# Altium schematic sheet ABM7-16.000MHZ-D2Y-T_2022-10-06.schdoc
size 49 x 33 mm
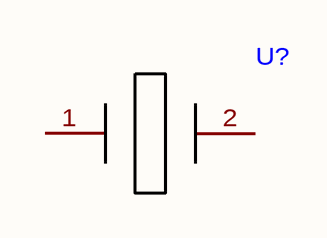
[diagram p0: ABM7-16.000MHZ-D2Y-T_2022-10-06.schdoc]

## Parts
U?  (no value)  [ABM7-16.000MHZ-D2Y-T CRYSTAL]

## Nets

Not connected (* = marked no-connect by the designer): U? 1 2

## Library data of the parts
U? = ABM7-16.000MHZ-D2Y-T